# Altium schematic sheet Sheet1.SchDoc
size A
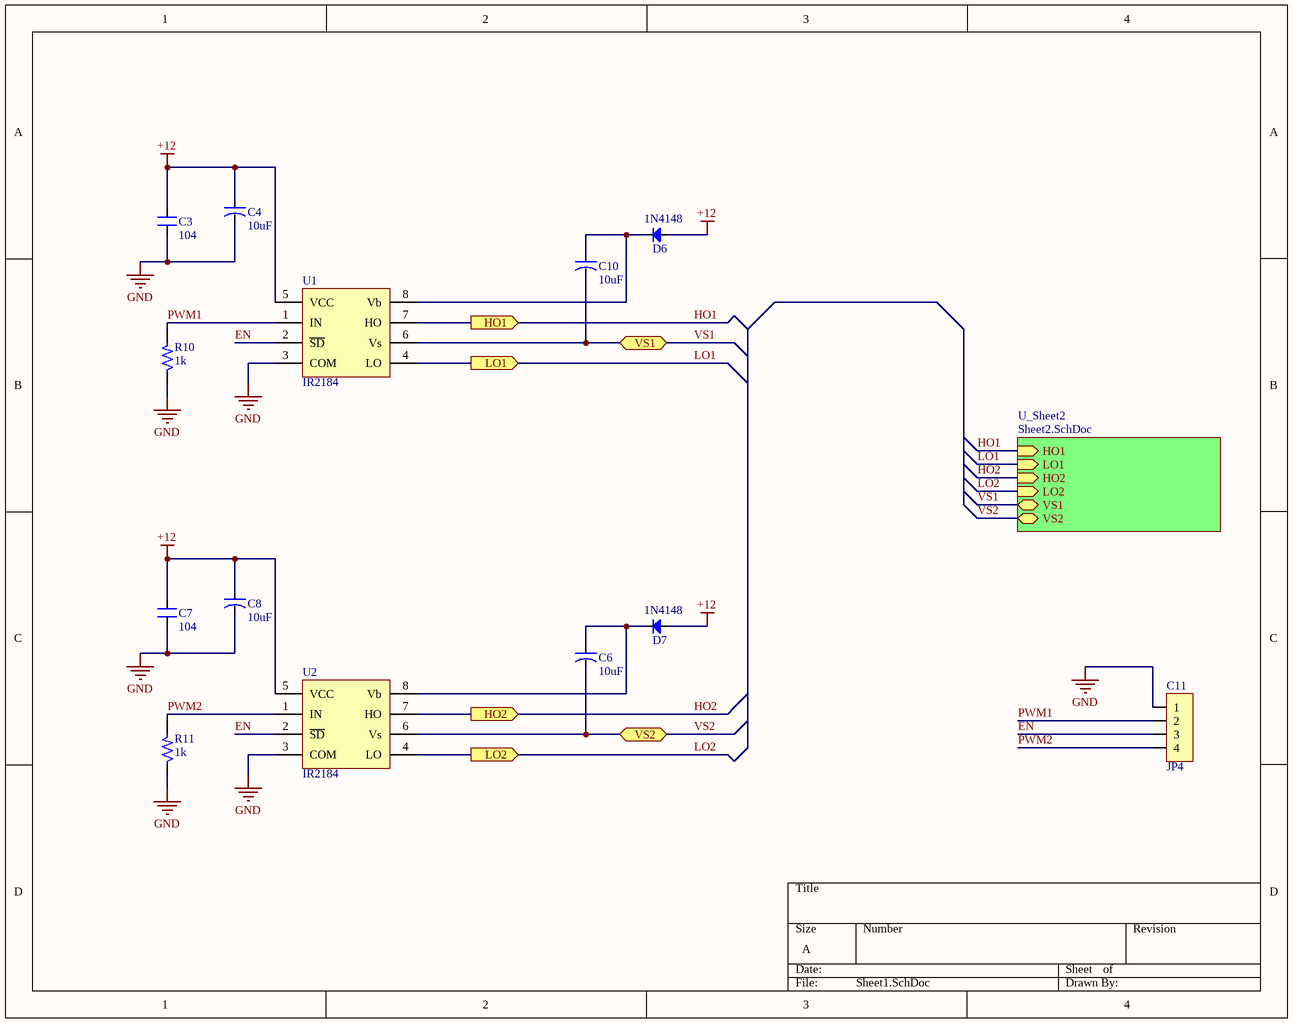
[diagram p0: Sheet1.SchDoc]

## Parts
C3  104  [SM-CAP-0805]
C4  10uF  [CAP-ALU-SMD-4.5x5x1.4]
C6  10uF  [CAP-ALU-SMD-4.5x5x1.4]
C7  104  [SM-CAP-0805]
C8  10uF  [CAP-ALU-SMD-4.5x5x1.4]
C10  10uF  [CAP-ALU-SMD-4.5x5x1.4]
C11  JP4  [JP4-C1T]
D6  1N4148  [DIO-SMD-106]
D7  1N4148  [DIO-SMD-106]
R10  1k  [SM-RES-1206]
R11  1k  [SM-RES-1206]
U1  IR2184  [SO8]
U2  IR2184  [SO8]

## Sub-sheets
U_Sheet2 = Sheet2.SchDoc: HO1 (in), LO1 (in), HO2 (in), LO2 (in), VS1 (bidir), VS2 (bidir)

## Ports
HO1 (out), HO2 (out), LO1 (out), LO2 (out), VS1 (bidir), VS2 (bidir)

## Nets
+12: C3.2 C4.1 C7.2 C8.1 D6.1(A) D7.1(A) U1.5(VCC) U2.5(VCC)
GND: C3.1 C4.2 C7.1 C8.2 C11.1 R10.1 R11.1 U1.3(COM) U2.3(COM)
EN: C11.3 U1.2(~{SD}) U2.2(~{SD})
HO1: U1.7(HO) ; port HO1, sheet U_Sheet2/HO1
HO2: U2.7(HO) ; port HO2, sheet U_Sheet2/HO2
LO1: U1.4(LO) ; port LO1, sheet U_Sheet2/LO1
LO2: U2.4(LO) ; port LO2, sheet U_Sheet2/LO2
PWM1: C11.2 R10.2 U1.1(IN)
PWM2: C11.4 R11.2 U2.1(IN)
VS1: C10.2 U1.6(Vs) ; port VS1, sheet U_Sheet2/VS1
VS2: C6.2 U2.6(Vs) ; port VS2, sheet U_Sheet2/VS2
NetC6_1: C6.1 D7.2(K) U2.8(Vb)
NetC10_1: C10.1 D6.2(K) U1.8(Vb)

## Library data of the parts
C3 C7 = CN: Value: 0,1uF/300V; Designed by: VanDungEvn
C4 C6 C8 C10 = CN-ALU-SMD: Polarized Capacitor (Axial); Published: 8-Jun-2000; LatestRevisionDate: 17-Jul-2002; LatestRevisionNote: Re-released for DXP Platform.; PackageReference: POLAR0.8; Publisher: Altium Limited
C11 = JP4: WR-PHD 2.54 mm Angled Socket Header; Manufacturer: W¨¹rth Elektronik eiSos GmbH; partNo: 613004143121; ComponentLink1 Description: Manufacturer; ComponentLink2 Description: Datasheet; NoPins: 04; Created Date: 29 March 2013; ComponentLink1URL: http://www.we-online.com; ComponentLink2URL: http://katalog.we-online.de/em/datasheet/6130xx143121.pdf; Created by: Karrer Zheng
D6 D7 = Diode SMD: Default Diode; Code - JEDEC: DO-214-AB; Value: 1N5007; Published: 8-Jun-2000; Revision: July-2002: Re-released for DXP Platform.; Publisher: Altium Limited
R10 R11 = R: Resistor 1/4W; Value: R1/4W - 1K
U1 U2 = IR2184: Half-Bridge Driver